# Altium project mcudevkit.PrjPcb (part 3 of 3)

## Sheet BARTGL.SchDoc
size A3; SheetNumber: 22; SheetTotal: 22
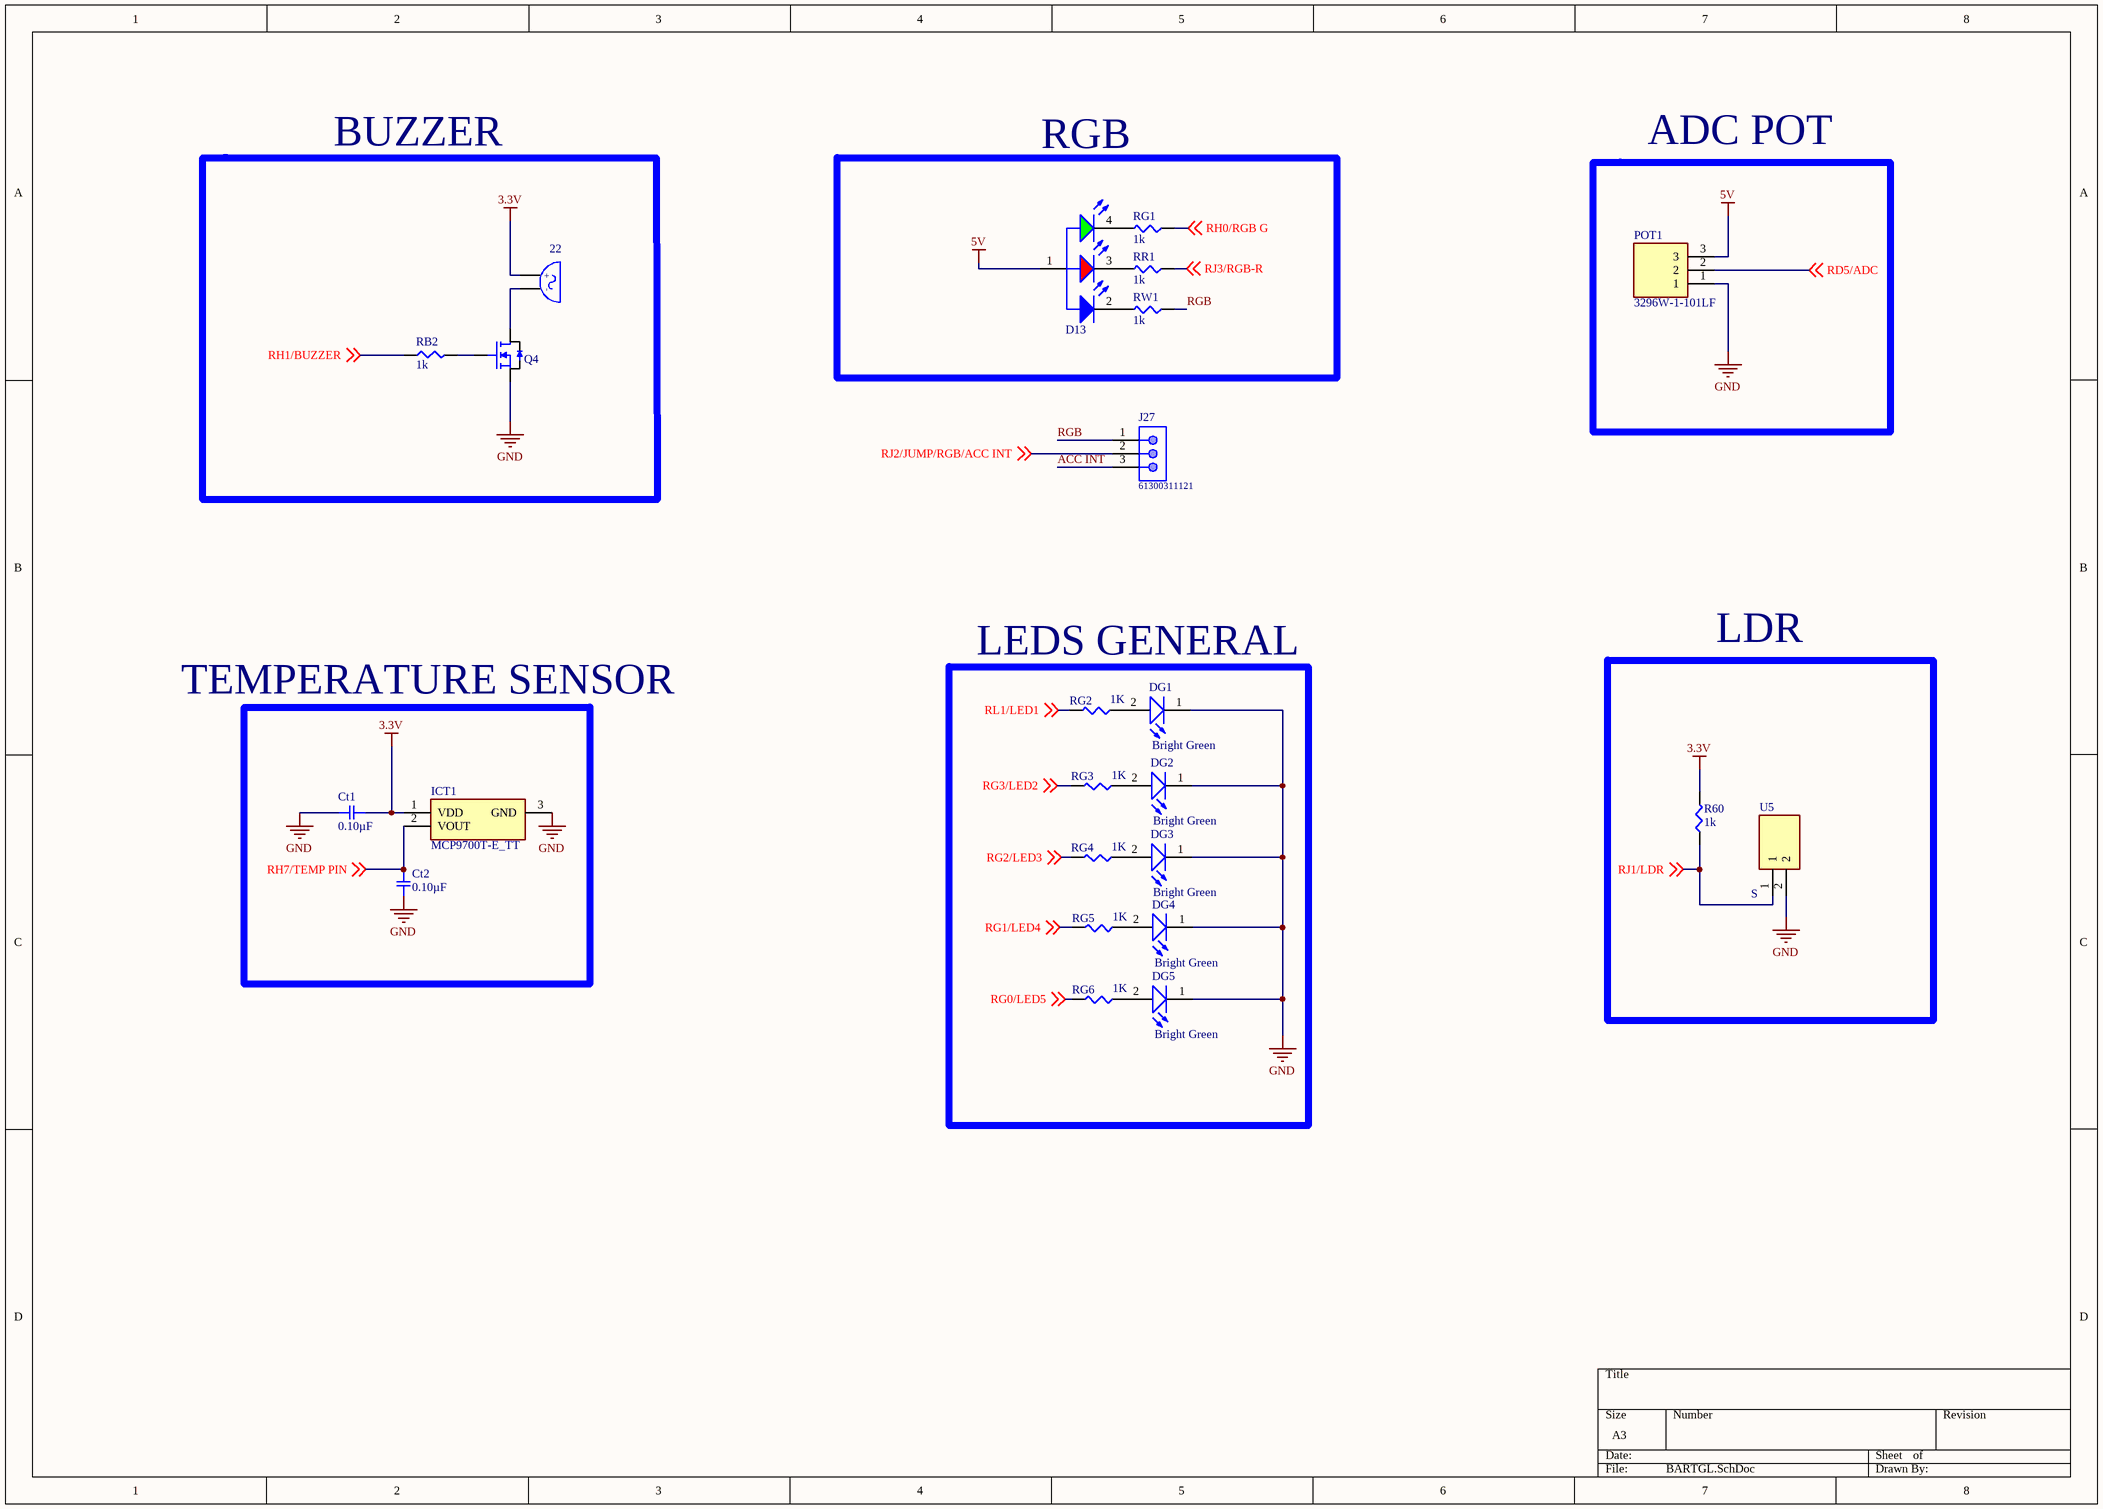
[diagram p21: BARTGL.SchDoc]

### Parts
22  WST-1205S  [Buzzer 5v]  (value not drawn)
Ct1  0.10µF  [SMD-0805C]
Ct2  0.10µF  [SMD-0805C]
D13  Red & Green & Blue, 120°  [WL-SFTW_3528_150141M173100]  (value not drawn)
DG1  Emitting Color: Bright Green  [WL-SMCW_0805]  (hidden comment: 150080VS75000)
DG2  Emitting Color: Bright Green  [WL-SMCW_0805]  (hidden comment: 150080VS75000)
DG3  Emitting Color: Bright Green  [WL-SMCW_0805]  (hidden comment: 150080VS75000)
DG4  Emitting Color: Bright Green  [WL-SMCW_0805]  (hidden comment: 150080VS75000)
DG5  Emitting Color: Bright Green  [WL-SMCW_0805]  (hidden comment: 150080VS75000)
ICT1  MCP9700T-E_TT  [SOT95P237X112-3N]
J27  61300311121  [61300311121]
POT1  3296W-1-101LF  [3296W-1]
Q4  S12302DS Nchanel SMD SOT-23  [SOT-23-3N]  (value not drawn)
R60  1k  [SMD-0805-RES]
RB2  1k  [SMD-0805-RES]
RG1  1k  [SMD-0805-RES]
RG2  1K  [SMD-0805-RES]
RG3  1K  [SMD-0805-RES]
RG4  1K  [SMD-0805-RES]
RG5  1K  [SMD-0805-RES]
RG6  1K  [SMD-0805-RES]
RR1  1k  [SMD-0805-RES]
RW1  1k  [SMD-0805-RES]
U5  S  [NSL-19M51]

### Blocks framed on the sheet
BUZZER: 22 Q4 RB2
RGB: D13 RG1 RR1 RW1
ADC POT: POT1
LEDS GENERAL: DG1-DG5 RG2-RG6
LDR: R60 U5

### Nets
3.3V: 22.1 Ct1.1 ICT1.1(VDD) R60.2
5V: D13.1(A) POT1.3
GND: Ct1.2 Ct2.2 DG1.1(K) DG2.1(K) DG3.1(K) DG4.1(K) DG5.1(K) ICT1.3(GND) POT1.1 Q4.2(Source) U5.2
ACC INT: J27.3
RD5/ADC: POT1.2 ; off-sheet RD5/ADC
RG0/LED5: RG6.2 ; off-sheet RG0/LED5
RG1/LED4: RG5.2 ; off-sheet RG1/LED4
RG2/LED3: RG4.2 ; off-sheet RG2/LED3
RG3/LED2: RG3.2 ; off-sheet RG3/LED2
RGB: J27.1 RW1.1
RH0/RGB G: RG1.1 ; off-sheet RH0/RGB G
RH1/BUZZER: RB2.1 ; off-sheet RH1/BUZZER
RH7/TEMP PIN: Ct2.1 ICT1.2(VOUT) ; off-sheet RH7/TEMP PIN
RJ1/LDR: R60.1 U5.1 ; off-sheet RJ1/LDR
RJ2/JUMP/RGB/ACC INT: J27.2 ; off-sheet RJ2/JUMP/RGB/ACC INT
RJ3/RGB-R: RR1.1 ; off-sheet RJ3/RGB-R
RL1/LED1: RG2.2 ; off-sheet RL1/LED1
Net22_2: 22.2 Q4.3(Drain)
NetD13_2: D13.2(K) RW1.2
NetD13_3: D13.3(K) RR1.2
NetD13_4: D13.4(K) RG1.2
NetDG1_2: DG1.2(A) RG2.1
NetDG2_2: DG2.2(A) RG3.1
NetDG3_2: DG3.2(A) RG4.1
NetDG4_2: DG4.2(A) RG5.1
NetDG5_2: DG5.2(A) RG6.1
NetQ4_1: Q4.1(Gate) RB2.2

### Notes on the sheet
- TEMPERATURE SENSOR
- (in symbol Buzzer) +; -

### Library data of the parts
22 = Buzzer: Buzzer 2.3khz 4-6vdc Pcb Wash; MF: Soberton Inc.; Package: Soberton Inc.; MP: WST-1205S; Price: None; Availability: Unavailable; SnapEDA_Link: https://www.snapeda.com/parts/WST-1205S/Soberton%20Inc./view-part/?ref=snap; Value: *
Ct1 Ct2 = GCD21BR71H104KA01L: CAP CER 0.1UF 50V X7R 0805; Manufacturer: Murata Electronics North America; Factory Stock: 0; Unit Price (USD): 0.24; Minimum Quantity: 1; Tolerance: ±10%; Datasheets: http://www.murata.com/~/media/webrenewal/support/library/catalog/products/capacitor/mlcc/c03e.ashx; Image: //media.digikey.com/Renders/Murata%20Renders/0805%28GxM6%29.jpg; Digi-Key Part Number: 490-11955-1-ND; Part Number: GCD21BR71H104KA01L; Quantity Available: 157; @ qty: 0; Packaging: Cut Tape (CT); Series: GCD; Part Status: Active; Value: 0.10µF; Voltage: 50V; Temperature Coefficient: X7R; Operating Temperature: -55°C ~ 125°C; Features: -; Ratings: AEC-Q200; Applications: Automotive; Mounting Type: Surface Mount, MLCC; Package / Case: 0805 (2012 Metric); Size / Dimension: 0.079" L x 0.049" W (2.00mm x 1.25mm); Height - Seated (Max): -; Thickness (Max): 0.049" (1.25mm); Lead Spacing: -; Lead Style: -
D13 = 150141M173100: WL-SFTW Full-color TOP LED Waterclear, size 3528, Red & Green & Blue, 120°; Manufacturer: Wurth Elektronik; Case/Size Code: 3528; Chip Technology: AlInGaP + InGaN; Dominant Wavelength (Blue): 470nm; Dominant Wavelength (Green): 520nm; Dominant Wavelength (Red): 625nm; Forward Voltage (Blue): 3.2V; Forward Voltage (Red): 2V; Luminous Intensity (Blue): 230mcd; Luminous Intensity (Green): 950mcd; Luminous Intensity (Red): 270mcd; Peak Wavelength (Blue): 465nm; Peak Wavelength (Green): 515nm; Peak Wavelength (Red): 635nm; Manufacturer Part Number: 150141M173100; Category: Signal LEDs; Match Code: WL-SFTW; ComponentLink1Description: Website Link; ComponentLink1URL: https://www.we-online.com/redexpert/article/150141M173100?ad; ComponentLink2Description: Datasheet Link; ComponentLink2URL: https://www.we-online.com/redexpert/spec/150141M173100?ad; Mount: Surface Mount; Operating Temperature Max: 85°C; Operating Temperature Min: -40°C; Packaging: Tape and Reel; Length: 3.5mm; Width: 2.8mm; Height: 1.9mm; Emitting Color: Red & Green & Blue; Forward Voltage (Green): 3.2V; Viewing Angle: 120°
DG1-DG5 = 150080VS75000: WL-SMCW SMD Mono-color Chip LED Waterclear, size 0805, Bright Green; Forward Voltage: 2 V; Viewing Angle: 140°; Peak Wavelength: 572 nm; Published Date: Jan 2017; Publisher: Wurth Elektronik; ComponentLink1Description: Manufacturer; ComponentLink1URL: http://www.we-online.de; ComponentLink2Description: Datasheet; ComponentLink2URL: http://katalog.we-online.de/led/datasheet/150080VS75000.pdf; Part Number: 150080VS75000; Size: 0805
ICT1 = MCP9700T-E_TT: Integrated Circuit; Manufacturer_Name: Microchip; Manufacturer_Part_Number: MCP9700T-E/TT; Datasheet Link: https://datasheet.datasheetarchive.com/originals/distributors/Datasheets-DGA2/179941.pdf; Height: 1.12mm; Mouser Part Number: 579-MCP9700T-E/TT; Mouser Price/Stock: https://www.mouser.co.uk/ProductDetail/Microchip-Technology/MCP9700T-E-TT?qs=QVBMgXxBiLyzQ04uBGj3mg%3D%3D; Arrow Part Number: MCP9700T-E/TT; Arrow Price/Stock: https://www.arrow.com/en/products/mcp9700t-ett/microchip-technology?region=nac
J27 = 61300311121: WR-PHD Pin Header, THT, pitch 2.54mm, Single Row, Vertical, 3pin; Pin Number: 3; Gender: Male; Rated Current: 3A; Working Voltage: 250VAC; Withstanding Voltage: 500VAC; Contact Resistance: 20mOhm; ComponentLink1Description: Manufacturer; ComponentLink1URL: http://www.we-online.de; ComponentLink2Description: Datasheet; ComponentLink2URL: https://katalog.we-online.de/em/datasheet/6130xx11121.pdf; Part Number: 61300311121; Published Date: June 2019; Publisher: Wurth Elektronik; Pitch: 2.54mm; Operating Temperature: -40 to +105degC; Mounting Technology: THT; Packaging: Bag; Row Number: Single; Orientation: Vertical
POT1 = 3296W-1-101LF: Resistor; Manufacturer_Name: Bourns; Datasheet Link: https://www.bourns.com/pdfs/3296.pdf; Manufacturer_Part_Number: 3296W-1-101LF; Mouser Part Number: 652-3296W-1-101LF; Mouser Price/Stock: https://www.mouser.co.uk/ProductDetail/Bourns/3296W-1-101LF?qs=UcU9LKO1dwEefwKxVJG4Jw%3D%3D; Arrow Part Number: 3296W-1-101LF; Arrow Price/Stock: https://www.arrow.com/en/products/3296w-1-101lf/bourns?region=nac
Q4 = S12302DS: S12302DS Nchanel SMD SOT-23. VDS MAX 20. 400Ma DI
R60 RB2 RG1-RG6 RR1 RW1 = ERJ-6ENF1001V: RES SMD 1K OHM 1% 1/8W 0805; Manufacturer: Panasonic Electronic Components; Factory Stock: 0; Unit Price (USD): 0.00729; @ qty: 1500; Minimum Quantity: 1; Power (Watts): 0.125W, 1/8W; Temperature Coefficient: ±100ppm/°C; Part Number: ERJ-6ENF1001V; Datasheets: http://industrial.panasonic.com/www-cgi/jvcr13pz.cgi?E+PZ+3+AOA0002+ERJ6ENF1001V+7+WW; Image: //media.digikey.com/Renders/Panasonic%20Renders/ERJ-0805%20Pkg.jpg; Digi-Key Part Number: P1.00KCCT-ND; Quantity Available: 12895103; Packaging: Cut Tape (CT); Series: ERJ; Part Status: Active; Value: 1k; Tolerance: ±1%; Composition: Thick Film; Features: Automotive AEC-Q200; Operating Temperature: -55°C ~ 155°C; Package / Case: 0805 (2012 Metric); Supplier Device Package: 0805; Size / Dimension: 0.079" L x 0.049" W (2.00mm x 1.25mm); Height - Seated (Max): 0.028" (0.70mm); Number of Terminations: 2; Failure Rate: -
U5 = NSL-19M51: Undefined or Miscellaneous; Manufacturer_Name: Silonex; Datasheet Link: http://uk.rs-online.com/web/p/products/9146710; Manufacturer_Part_Number: NSL-19M51

## Nets that join several sheets
3.3V: Motherboard (6 pins), powersupply (5 pins), 7segment (Q3.4 Q3.6), Rtc (5 pins), Usb to Uart (C24.1 C25.1 IC7.1 R38.1), SPI FLASH (IC8.3 IC8.7 IC8.8), RS-485 (6 pins), DAC SPI (C29.2 C30.1 IC11.1), Lan (5 pins), I2C EXTERNAL (IC12.9 R49.2), wwdt (IC13.5), DIGITAL POT (IC16.1 IC16.7 IC16.8), Rotary Encoder (R55.2 R56.2 R57.2), USB (J20.1 R58.1 R59.2), ACCELEROMETER (AC1.9 AC1.10 C41.1 C42.1), Current SENSOR (8 pins), OPAMP (C47.1 C48.1 IC4.8), BARTGL (22.1 Ct1.1 ICT1.1 R60.2)
3V3_MCU: Motherboard (J5.2 M1.44 M1.57), Current SENSOR (IC_CS1.4 R62.2 R63.2 R64.2)
5V: Motherboard (6 pins), stepper_motodriver (C4.1 IC1.4 IC1.8 IC1.10), powersupply (5 pins), 7segment (U2.9 U3.9), Usb to Uart (FB1.1), CAN (6 pins), BARTGL (D13.1 POT1.3)
12V: Motherboard (J4.7 J29.7 P1.1), relaymodule (D1.2 D2.2 K1.A1 K2.A1), stepper_motodriver (C1.1 C2.1 IC1.24), powersupply (10 pins)
GND: Motherboard (17 pins), relaymodule (Q1.2 Q2.2 R2.1 R4.1), stepper_motodriver (19 pins), matrixkeypad (R16.1 R17.1 R18.1), powersupply (18 pins), Rtc (6 pins), Usb to Uart (10 pins), SPI FLASH (IC8.4), RS-485 (8 pins), DAC SPI (C29.1 C30.2 IC11.5 IC11.7), Lan (13 pins), I2C EXTERNAL (5 pins), wwdt (IC13.2 S12.1), CAN (8 pins), DIGITAL POT (IC16.4 IC16.5 J19.2 T_PAD1.1), Rotary Encoder (U4.C1 U4.E1), USB (J20.4 J20.Shell), ACCELEROMETER (6 pins), Current SENSOR (7 pins), OPAMP (7 pins), BARTGL (11 pins)
ACC INT: ACCELEROMETER (AC1.12), BARTGL (J27.3)
CAN_Rx1: Motherboard (M1.48), CAN (IC14.4)
CAN_Rx2: Motherboard (M1.50), CAN (IC15.4)
CAN_Tx1: Motherboard (M1.47), CAN (IC14.1)
CAN_Tx2: Motherboard (M1.49), CAN (IC15.1)
MCLR: Motherboard (J5.1 M1.56), wwdt (IC13.1 J16.3)
OPAMP IN: DIGITAL POT (IC16.6 J19.1 T_PAD1.2), OPAMP (IC4.3)
RA1/SCK: Motherboard (5 pins), SPI FLASH (IC8.6), DAC SPI (IC11.3), Lan (ENC1.8), ACCELEROMETER (AC1.1)
RA2/SDO: Motherboard (5 pins), SPI FLASH (IC8.2), Lan (ENC1.6), ACCELEROMETER (AC1.3)
RA3/SDI: Motherboard (5 pins), SPI FLASH (IC8.5), DAC SPI (IC11.4), Lan (ENC1.7), ACCELEROMETER (AC1.4)
RC2/SS6: Motherboard (M1.9), DAC SPI (IC11.2)
RC3/SCL: Motherboard (J4.4 J29.4 M1.41 P2.3), Rtc (IC5.6 R36.2), I2C EXTERNAL (IC12.12), DIGITAL POT (IC16.2)
RC4/SDA: Motherboard (J4.5 J29.5 M1.43 P2.2), Rtc (IC5.5 R35.2), I2C EXTERNAL (IC12.13), DIGITAL POT (IC16.3)
RC7/SS5: Motherboard (M1.8), SPI FLASH (IC8.1)
RD0/PWMOUT01: Motherboard (M1.71), stepper_motodriver (IC1.13)
RD1/PWMOUT11: Motherboard (M1.73), stepper_motodriver (IC1.12)
RD2/Phase1: Motherboard (M1.75), stepper_motodriver (IC1.11)
RD3/Phase2: Motherboard (M1.76), stepper_motodriver (IC1.3)
RD4/WDT: Motherboard (M1.77), wwdt (IC13.4)
RD5/ADC: Motherboard (M1.78), BARTGL (POT1.2)
RE0/SS8: Motherboard (M1.37), ACCELEROMETER (AC1.2)
RE1/SS7: Motherboard (M1.38), Lan (ENC1.9)
RE2/RX1: Motherboard (M1.63), RS-485 (IC10.4)
RE3/TX1: Motherboard (M1.64), RS-485 (IC10.1 R42.2)
RE4/TX2: Motherboard (M1.66), RS-485 (J10.2)
RE7/DIR2: Motherboard (M1.69), RS-485 (IC10.3)
Relay/Out1: relaymodule (R1.2), 7segment (U3.13)
Relay/Out2: relaymodule (R3.2), 7segment (U3.14)
RF2/ROTARY 2: Motherboard (M1.22), Rotary Encoder (R55.1 U4.A1)
RF3/D-: Motherboard (M1.23), USB (J20.2 R58.2)
RF4/D+: Motherboard (M1.25), USB (J20.3 R59.1)
RF5/KEY1: Motherboard (M1.26), matrixkeypad (S1.2 S2.2 S3.2)
RF6/KEY2: Motherboard (M1.27), matrixkeypad (S4.2 S5.2 S6.2)
RF7/KEY3: Motherboard (M1.28), matrixkeypad (S7.2 S8.2 S9.2)
RG0/LED5: Motherboard (M1.36), BARTGL (RG6.2)
RG1/LED4: Motherboard (M1.35), BARTGL (RG5.2)
RG2/LED3: Motherboard (M1.34), BARTGL (RG4.2)
RG3/LED2: Motherboard (M1.33), BARTGL (RG3.2)
RG4/KEY6: Motherboard (M1.31), matrixkeypad (R14.1)
RG6/PWMOUT02: Motherboard (M1.72), stepper_motodriver (IC1.1)
RG7/RX2: Motherboard (M1.65), RS-485 (J11.2)
RH0/RGB G: Motherboard (M1.51), BARTGL (RG1.1)
RH1/BUZZER: Motherboard (M1.54), BARTGL (RB2.1)
RH2/RELAY2: Motherboard (M1.40), 7segment (U3.4)
RH3/RELAY1: Motherboard (M1.39), 7segment (U3.3)
RH4/SEG4: Motherboard (M1.13), 7segment (U2.4)
RH5/SEG3: Motherboard (M1.12), 7segment (U2.3)
RH6/SEG2: Motherboard (M1.11), 7segment (U2.2)
RH7/TEMP PIN: Motherboard (M1.21), BARTGL (Ct2.1 ICT1.2)
RJ1/LDR: Motherboard (M1.55), BARTGL (R60.1 U5.1)
RJ2/JUMP/RGB/ACC INT: Motherboard (M1.53), BARTGL (J27.2)
RJ3/RGB-R: Motherboard (M1.52), BARTGL (RR1.1)
RJ4/SEG CON: Motherboard (M1.17), 7segment (U3.1)
RJ5/SEG CON: Motherboard (M1.18), 7segment (U3.2)
RJ6/ INT LAN: Motherboard (M1.19), Lan (ENC1.4)
RJ7/ROTARY1: Motherboard (M1.20), Rotary Encoder (R57.1 U4.B1)
RK0/SEG1: Motherboard (M1.10), 7segment (U2.1)
RK1/RESET LAN: Motherboard (M1.42), Lan (J14.2)
RK2/VUSB: Motherboard (M1.45), Usb to Uart (D11.3 R37.2 R39.1)
RK4/SEG7: Motherboard (M1.16), 7segment (U2.7)
RK7/PWMOUT12: Motherboard (M1.74), stepper_motodriver (IC1.2)
RL0/DIR1: Motherboard (M1.70), RS-485 (IC9.3)
RL1/LED1: Motherboard (M1.32), BARTGL (RG2.2)
RL2/KEY5: Motherboard (M1.30), matrixkeypad (R13.1)
RL3/KEY4: Motherboard (M1.29), matrixkeypad (R15.1)
RL4/ROTARY 3: Motherboard (M1.24), Rotary Encoder (R56.1 U4.D1)
RL5/SEG5: Motherboard (M1.14), 7segment (U2.5)
RL6/SEG6: Motherboard (M1.15), 7segment (U2.6)
USB/RX2: Usb to Uart (IC7.10), RS-485 (J11.3)
USB/TX2: Usb to Uart (IC7.12), RS-485 (J10.3)